# Altium schematic sheet WX0.007.419DL.SchDoc
size A3
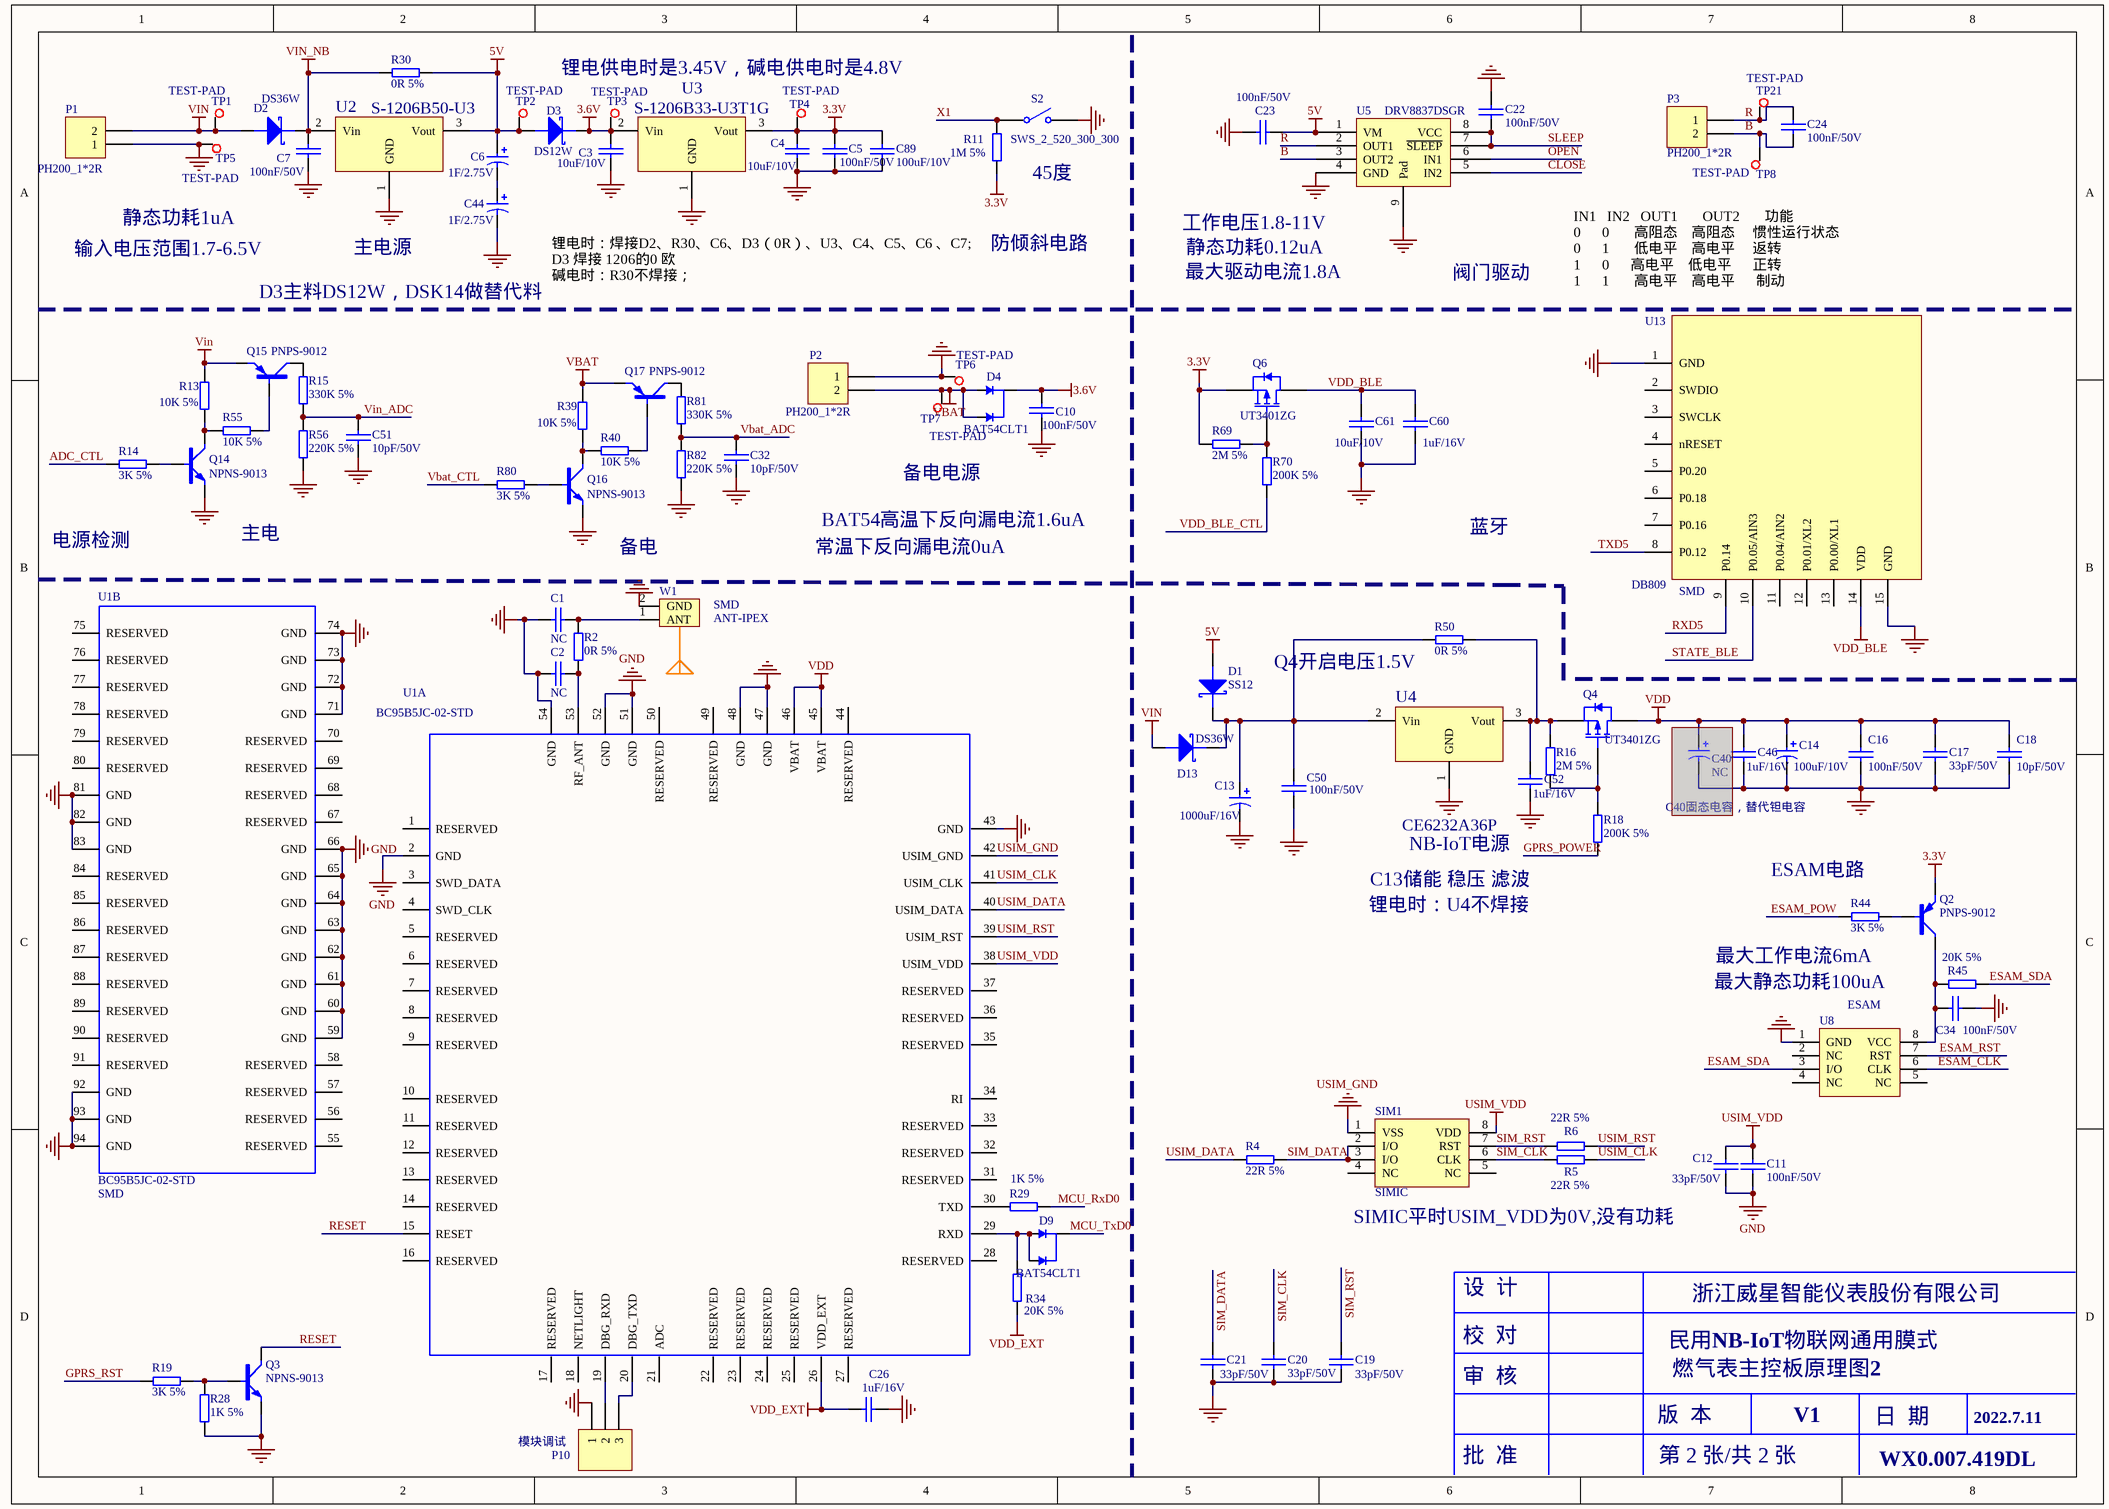
[diagram p0: WX0.007.419DL.SchDoc]

## Parts
C1  NC  [CAP0603]
C2  NC  [CAP0603]
C3  10uF/10V  [CAP0603]
C4  10uF/10V  [CAP0603]
C5  100nF/50V  [CAP0603]
C6  1F/2.75V  [CAPPC_350_800_1600R]
C7  100nF/50V  [CAP0603]
C10  100nF/50V  [CAP0603]
C11  100nF/50V  [CAP0603]
C12  33pF/50V  [CAP0603]
C13  1000uF/16V  [CAPPC_500_800_2000R]
C14  100uF/10V  [CAT3528]
C16  100nF/50V  [CAP0603]
C17  33pF/50V  [CAP0603]
C18  10pF/50V  [CAP0603]
C19  33pF/50V  [CAP0603]
C20  33pF/50V  [CAP0603]
C21  33pF/50V  [CAP0603]
C22  100nF/50V  [CAP0603]
C23  100nF/50V  [CAP0603]
C24  100nF/50V  [CAP0603]
C26  1uF/16V  [CAP0603]
C32  10pF/50V  [CAP0603]
C34  100nF/50V  [CAP0603]
C40  NC  [6.3*5.8]  (masked out: inside a compile mask, not in the netlist)
C44  1F/2.75V  [CAPPC_350_800_1600R]
C46  1uF/16V  [CAP0603]
C50  100nF/50V  [CAP0603]
C51  10pF/50V  [CAP0603]
C52  1uF/16V  [CAP0603]
C60  1uF/16V  [CAP0603]
C61  10uF/10V  [CAP0603]
C89  100uF/10V  [CAT3528]
D1  SS12  [DO-214AC]
D2  DS36W  [SOD-123FL]
D3  DS12W  [SOD-123FL]
D4  BAT54CLT1  [SOT-23]
D9  BAT54CLT1  [SOT-23]
D13  DS36W  [SOD-123FL]
P1  PH200_1*2R  [PH200_1*2R]
P2  PH200_1*2R  [PH200_1*2R]
P3  PH200_1*2R  [PH200_1*2R]
P10  模块调试  [PIN254_1*3*WXHJ]
Q2  PNPS-9012  [SOT-23]
Q3  NPNS-9013  [SOT-23]
Q4  UT3401ZG  [SOT-23]
Q6  UT3401ZG  [SOT-23]
Q14  NPNS-9013  [SOT-23]
Q15  PNPS-9012  [SOT-23]
Q16  NPNS-9013  [SOT-23]
Q17  PNPS-9012  [SOT-23]
R2  0R 5%  [RES0603]
R4  22R 5%  [RES0603]
R5  22R 5%  [RES0603]
R6  22R 5%  [RES0603]
R11  1M 5%  [RES0603]
R13  10K 5%  [RES0603]
R14  3K 5%  [RES0603]
R15  330K 5%  [RES0603]
R16  2M 5%  [RES0603]
R18  200K 5%  [RES0603]
R19  3K 5%  [RES0603]
R28  1K 5%  [RES0603]
R29  1K 5%  [RES0603]
R30  0R 5%  [RES1206]
R34  20K 5%  [RES0603]
R39  10K 5%  [RES0603]
R40  10K 5%  [RES0603]
R44  3K 5%  [RES0603]
R45  20K 5%  [RES0603]
R50  0R 5%  [RES1206]
R55  10K 5%  [RES0603]
R56  220K 5%  [RES0603]
R69  2M 5%  [RES0603]
R70  200K 5%  [RES0603]
R80  3K 5%  [RES0603]
R81  330K 5%  [RES0603]
R82  220K 5%  [RES0603]
S2  SWS_2_520_300_300  [SWS_2_520_300]
SIM1  SIMIC  [SIMIC]
TP1  TEST-PAD  [TEST-PAD]
TP2  TEST-PAD  [TEST-PAD]
TP3  TEST-PAD  [TEST-PAD]
TP4  TEST-PAD  [TEST-PAD]
TP5  TEST-PAD  [TEST-PAD]
TP6  TEST-PAD  [TEST-PAD]
TP7  TEST-PAD  [TEST-PAD]
TP8  TEST-PAD  [TEST-PAD]
TP21  TEST-PAD  [TEST-PAD]
U1  BC95B5JC-02-STD  SMD/DIP: SMD  [BC95B5JB-02-STD]  (parts A,B of 2)
U2  S-1206B50-U3  [SOT-89]
U3  S-1206B33-U3T1G  [SOT-89]
U4  CE6232A36P  [SOT-89]
U5  DRV8837DSGR  [S-PWSON-N8]
U8  ESAM  [SOP-8L-200MIL]
U13  DB809  SMD/DIP: SMD  [DB809]
W1  ANT-IPEX  [ANT-IPEX]

## Nets
3.3V: C4.1 C5.1 C89.1 Q2.2(E) Q6.2(S) R11.1 R69.1 TP4.1 U3.3(Vout)
3.6V: C3.1 C10.1 D3.2 D4.3(C) TP3.1 U3.2(Vin)
5V: C6.1 C23.2 D1.1 D3.1 R30.2 TP2.1 U2.3(Vout) U5.1(VM)
GND: C1.1 C2.1 C3.2 C4.2 C5.2 C7.2 C10.2 C11.2 C12.2 C13.2 C14.2 C16.2 C17.2 C18.2 C19.2 C20.2 C21.2 C22.1 C23.1 C26.2 C32.1 C34.2 C44.2 C46.2 C50.2 C51.1 C52.2 C60.2 C61.2 C89.2 P1.1 P2.1 P10.1 Q3.2(E) Q14.2(E) Q16.2(E) R28.1 R56.2 R82.2 S2.2 TP5.1 TP6.1 U1.2(GND) U1.43(GND) U1.47(GND) U1.48(GND) U1.51(GND) U1.52(GND) U1.54(GND) U1.59(GND) U1.60(GND) U1.61(GND) U1.62(GND) U1.63(GND) U1.64(GND) U1.65(GND) U1.66(GND) U1.71(GND) U1.72(GND) U1.73(GND) U1.74(GND) U1.81(GND) U1.82(GND) U1.83(GND) U1.92(GND) U1.93(GND) U1.94(GND) U2.1(GND) U3.1(GND) U4.1(GND) U5.4(GND) U5.9(Pad) U8.1(GND) U13.1(GND) U13.15(GND) W1.2(GND)
USIM_GND: SIM1.1(VSS) U1.42(USIM_GND)
USIM_VDD: C11.1 C12.1 SIM1.8(VDD) U1.38(USIM_VDD)
VBAT: D4.1(A) D4.2(A) P2.2 Q17.2(E) R39.2 TP7.1
VDD: C14.1 C16.1 C17.1 C18.1 C46.1 Q4.3(D) U1.45(VBAT) U1.46(VBAT)
VDD_BLE: C60.1 C61.1 Q6.3(D) U13.14(VDD)
VDD_EXT: C26.1 R34.1 U1.26(VDD_EXT)
VIN: D2.1 D13.1 P1.2 Q15.2(E) R13.2 TP1.1
VIN_NB: C7.1 D2.2 R30.1 U2.2(Vin)
ADC_CTL: R14.1
B: C24.2 P3.2 TP8.1 U5.3(OUT2)
CLOSE: U5.5(IN2)
ESAM_CLK: U8.6(CLK)
ESAM_POW: R44.1
ESAM_RST: U8.7(RST)
ESAM_SDA: R45.2 U8.3(I/O)
GPRS_POWER: R18.1
GPRS_RST: R19.1
MCU_RxD0: R29.2
MCU_TxD0: D9.3(C)
OPEN: U5.6(IN1)
R: C24.1 P3.1 TP21.1 U5.2(OUT1)
RESET: Q3.3(C) U1.15(RESET)
RXD5: U13.9(P0.14)
SIM_CLK: C20.1 R5.1 SIM1.6(CLK)
SIM_DATA: C21.1 R4.2 SIM1.2(I/O) SIM1.3(I/O)
SIM_RST: C19.1 R6.1 SIM1.7(RST)
SLEEP: C22.2 U5.7(~{SLEEP}) U5.8(VCC)
STATE_BLE: U13.10(P0.05/AIN3)
TXD5: U13.8(P0.12)
USIM_CLK: R5.2 U1.41(USIM_CLK)
USIM_DATA: R4.1 U1.40(USIM_DATA)
USIM_RST: R6.2 U1.39(USIM_RST)
Vbat_ADC: C32.2 R81.2 R82.1
Vbat_CTL: R80.1
VDD_BLE_CTL: R70.1
Vin_ADC: C51.2 R15.2 R56.1
X1: R11.2 S2.1
NetC1_2: C1.2 R2.1 W1.1(ANT)
NetC2_2: C2.2 R2.2 U1.53(RF_ANT)
NetC6_2: C6.2 C44.1
NetC13_1: C13.1 C50.1 D1.2 D13.2 R50.1 U4.2(Vin)
NetC34_1: C34.1 Q2.3(C) R45.1 U8.8(VCC)
NetC52_1: C52.1 Q4.2(S) R16.2 R50.2 U4.3(Vout)
NetD9_1: D9.1(A) D9.2(A) R34.2 U1.29(RXD)
NetP10_2: P10.2 U1.19(DBG_RXD)
NetP10_3: P10.3 U1.20(DBG_TXD)
NetQ2_1: Q2.1(B) R44.2
NetQ3_1: Q3.1(B) R19.2 R28.2
NetQ4_1: Q4.1(G) R16.1 R18.2
NetQ6_1: Q6.1(G) R69.2 R70.2
NetQ14_1: Q14.1(B) R14.2
NetQ14_3: Q14.3(C) R13.1 R55.1
NetQ15_1: Q15.1(B) R55.2
NetQ15_3: Q15.3(C) R15.1
NetQ16_1: Q16.1(B) R80.2
NetQ16_3: Q16.3(C) R39.1 R40.1
NetQ17_1: Q17.1(B) R40.2
NetQ17_3: Q17.3(C) R81.1
NetR29_1: R29.1 U1.30(TXD)

Not connected (* = marked no-connect by the designer): SIM1 4(NC) 5(NC); U1 1(RESERVED) 3(SWD_DATA) 4(SWD_CLK) 5(RESERVED) 6(RESERVED) 7(RESERVED) 8(RESERVED) 9(RESERVED) 10(RESERVED) 11(RESERVED) 12(RESERVED) 13(RESERVED) 14(RESERVED) 16(RESERVED) 17(RESERVED) 18(NETLIGHT) 21(ADC) 22(RESERVED) 23(RESERVED) 24(RESERVED) 25(RESERVED) 27(RESERVED) 28(RESERVED) 31(RESERVED) 32(RESERVED) 33(RESERVED) 34(RI) 35(RESERVED) 36(RESERVED) 37(RESERVED) 44(RESERVED) 49(RESERVED) 50(RESERVED) 55(RESERVED) 56(RESERVED) 57(RESERVED) 58(RESERVED) 67(RESERVED) 68(RESERVED) 69(RESERVED) 70(RESERVED) 75(RESERVED) 76(RESERVED) 77(RESERVED) 78(RESERVED) 79(RESERVED) 80(RESERVED) 84(RESERVED) 85(RESERVED) 86(RESERVED) 87(RESERVED) 88(RESERVED) 89(RESERVED) 90(RESERVED) 91(RESERVED); U8 2(NC) 4(NC) 5(NC); U13 2(SWDIO) 3(SWCLK) 4(nRESET) 5(P0.20) 6(P0.18) 7(P0.16) 11(P0.04/AIN2) 12(P0.01/XL2) 13(P0.00/XL1)

## Notes on the sheet
- 锂电供电时是3.45V，碱电供电时是4.8V
- 45度
- 静态功耗1uA
- 工作电压1.8-11V
- 输入电压范围1.7-6.5V
- D3主料DS12W，DSK14做替代料
- 主电源
- 锂电时：焊接D2、R30、C6、D3（0R）、U3、C4、C5、C6 、C7; D3 焊接 1206的0 欧
  碱电时：R30不焊接；
- 防倾斜电路
- 最大驱动电流1.8A
- 静态功耗0.12uA
- 阀门驱动
- IN1   IN2   OUT1       OUT2       功能
  0      0       高阻态    高阻态     惯性运行状态
  0      1       低电平    高电平     返转
  1      0      高电平    低电平      正转
  1      1       高电平    高电平      制动
- 备电电源
- 电源检测
- 主电
- 备电
- 常温下反向漏电流0uA
- BAT54高温下反向漏电流1.6uA
- 蓝牙
- Q4开启电压1.5V
- NB-IoT电源
- C40固态电容，替代钽电容
- 锂电时：U4不焊接
- C13储能 稳压 滤波
- (near R44) ESAM电路
- 最大静态功耗100uA
- 最大工作电流6mA
- SIMIC平时USIM_VDD为0V,没有功耗
- 设  计
- 浙江威星智能仪表股份有限公司
- 审  核
- 校  对
- 民用NB-IoT物联网通用膜式
- 燃气表主控板原理图2
- 批  准
- 版  本
- 第 2 张/共 2 张
- V1
- 日  期
- 2022.7.11
- WX0.007.419DL

## Library data of the parts
C1 C2 = 101020103-0005: 12P,50 V,±5%,0603,国巨,CC0603JRNPO9BN12; Part Name: 0603贴片电容; ID: 11; SMD/DIP: SMD; Part Number: 101020103-0005
C3 C4 C61 = 101020103-0026: 106pF,10 V,±10%,0603,村田,GRM188R61A106KE47D; Part Name: 0603贴片电容; ID: 8; SMD/DIP: SMD; Part Number: 101020103-0026
C5 C7 C10 C11 C16 C22-C24 C34 C50 = 101020103-0021: 104pF,50 V,±10%,0603,国巨,CC0603KRX7R9BB104; Part Name: 0603贴片电容; ID: 3; SMD/DIP: SMD; Part Number: 101020103-0021
C6 C44 = 1010202-0015: 1F,2.75 V,-20%~+20%,8mm*16mm,红宝石,2.7 DMC 1 M MY4 8X16; Part Name: 法拉电容; ID: 12; SMD/DIP: DIP; Part Number: 1010202-0015
C12 C17 C19-C21 = 101020103-0027: 33pF,50 V,±10%,0603,国巨,CC0603KRNPO9BN33; Part Name: 0603贴片电容; ID: 18; SMD/DIP: SMD; Part Number: 101020103-0027
C13 = 1010203-0029: 1000uF,16 V,±20%,8*20mm,Rubycon,16ZLH1000M; Part Name: 电解电容; ID: 2; SMD/DIP: DIP; Part Number: 1010203-0029
C14 = 1010205-0006: 100UF,10 V,±20%,3528,AVX / KEMET,TAJB107M010RNJ; Part Name: 3528贴片钽电容; ID: 5; SMD/DIP: SMD; Part Number: 1010205-0006
C18 C32 C51 = 101020103-0014: 10pF,50 V,±5%,0603,X7R,国巨,CC0603JRNPO9BN100; Part Name: 0603贴片电容; ID: 7; SMD/DIP: SMD; Part Number: 101020103-0014
C26 C46 C52 C60 = 101020103-0003: 105pF,16 V,±10%,0603,国巨,CC0603KRX7R7BB105; Part Name: 0603贴片电容; ID: 14; SMD/DIP: SMD; Part Number: 101020103-0003
C40 = SolidCap: 固态电容
C89 = 101020102-0012: 226P,10 V,±20%,0805,村田电子有限公司,GRM21BR61A226ME51L; Part Name: 贴片电容; ID: 20; SMD/DIP: SMD; Part Number: 101020102-0012
D1 = 101040101-0009: SS12,DO-214AC,1 A,0.55 V,20 V,昶鑫,SS12; Part Name: 贴片肖特基; ID: 13; SMD/DIP: SMD; Part Number: 101040101-0009
D2 = 101040101-0055: DS36W,SOD123-FL,3 A,42 V,60 V,浙江领晨科技有限公司,DS36W; Part Name: 贴片肖特基; ID: 34; SMD/DIP: SMD; Part Number: 101040101-0055
D3 = 101040101-0048: DS12W,SOD-123FL,1 A,0.55 V,20 V,领晨科技,DS12W; Part Name: 贴片肖特基; ID: 8; SMD/DIP: SMD; Part Number: 101040101-0048
D4 D9 = 101040101-0038: BAT54CLT1，SOT23-3,SOT23-3,0.2 A,0.8 V,30 V,安森美,BAT54CLT1; Part Name: 贴片肖特基; ID: 31; SMD/DIP: SMD; Part Number: 101040101-0038
D13 = 101040101-0048: DS36W,SOD123-FL,3 A,42 V,60 V,浙江领晨科技有限公司,DS36W; Part Number: 101040101-0055; Part Name: 贴片肖特基; ID: 8; SMD/DIP: SMD
P1-P3 = 1010902-0105: 2.0-2AW,直插弯座，2PIN，脚间距2mm，带防翘起,公头,单排,2.0-2AW;直插弯座，2PIN,脚间距2mm，带防翘起; Part Name: PH座; ID: 11; SMD/DIP: DIP; Part Number: 1010902-0105
P10 = AD_WXHJ_PinHeader_04: 1*3 ，Φ1.0 ，2.54mm，直脚,无需焊接器件; Part Name: 排针; ID: 27; SMD/DIP: DIP; Part Number: AD_WXHJ_PinHeader_04
Q2 = 101040201-0001: 9012,PNP,SOT-23,JCET;长电,S9012; Part Name: 贴片三极管; ID: 16; SMD/DIP: SMD; Part Number: 101040201-0001
Q3 = 101040201-0002: 9013,NPN,SOT-23,长电,S9013; Part Name: 贴片三极管; ID: 14; SMD/DIP: SMD; Part Number: 101040201-0002
Q4 Q6 = 101040201-0013: UT3401ZG,P-MOS,SOT-23,UTC,UT3401ZG; Part Name: 功率MOS管; ID: 18; SMD/DIP: SMD; Part Number: 101040201-0013
Q14 Q16 = 101040201-0002: 9013,NPN,SOT-23,长电,S9013; Part Name: 贴片三极管; ID: 15; SMD/DIP: SMD; Part Number: 101040201-0002
Q15 Q17 = 101040201-0001: 9012,PNP,SOT-23,JCET;长电,S9012; Part Name: 贴片三极管; ID: 17; SMD/DIP: SMD; Part Number: 101040201-0001
R2 = 101010103-0001: 国巨,±5%,0603,,155 ℃,-55 ℃,RC0603J2-070RL,无铅,200 ppm/℃,1/10W,,0R; Part Name: 0603贴片电阻; ID: 1; SMD/DIP: SMD; Part Number: 101010103-0001
R4-R6 = 101010103-0009: 国巨,±5%,0603,,155 ℃,-55 ℃,RC0603JR-0722RL,无铅,200 ppm/℃,1/10W,,22欧; Part Name: 0603贴片电阻; ID: 17; SMD/DIP: SMD; Part Number: 101010103-0009
R11 = 101010103-0002: 国巨,±5%,0603,,155 ℃,-55 ℃,RC0603JR-071ML,无铅,200 ppm/℃,1/10W,,1M; Part Name: 0603贴片电阻; ID: 10; SMD/DIP: SMD; Part Number: 101010103-0002
R13 R39 R40 R44 R55 = 101010103-0003: 国巨,±5%,0603,,155 ℃,-55 ℃,RC0603JR-0710KL,无铅,200 ppm/℃,1/10W,,10K; Part Name: 0603贴片电阻; ID: 7; SMD/DIP: SMD; Part Number: 101010103-0003
R14 R80 = 101010103-0006: 国巨,±5%,0603,,155 ℃,-55 ℃,RC0603JR-073KL,无铅,100 ppm/℃,1/10W,,3K; Part Name: 0603贴片电阻; ID: 23; SMD/DIP: SMD; Part Number: 101010103-0006
R15 R81 = 101010103-0066: 330K,±5%,1/10W,0603,国巨,RC0603JR-07330KL; Part Name: 0603贴片电阻; ID: 31; SMD/DIP: SMD; Part Number: 101010103-0066
R16 = 101010103-0025: 国巨,±5%,0603,,155 ℃,-55 ℃,RC0603JR-072ML,含铅,100 ppm/℃,1/10W,,2M; Part Name: 0603贴片电阻; ID: 20; SMD/DIP: SMD; Part Number: 101010103-0025
R18 = 101010103-0034: 200K,±5%,1/10W,0603,国巨,RC0603JR-07200KL; Part Name: 0603贴片电阻; ID: 13; SMD/DIP: SMD; Part Number: 101010103-0034
R19 = 101010103-0006: 国巨,±5%,0603,,155 ℃,-55 ℃,RC0603JR-073KL,无铅,100 ppm/℃,1/10W,,3K; Part Name: 0603贴片电阻; ID: 22; SMD/DIP: SMD; Part Number: 101010103-0006
R28 = 101010103-0008: 1K,±5%,1/10W,0603,国巨,RC0603JR-071KL; Part Name: 0603贴片电阻; ID: 10; SMD/DIP: SMD; Part Number: 101010103-0008
R29 = 101010103-0008: 1K,±5%,1/10W,0603,国巨,RC0603JR-071KL; Part Name: 0603贴片电阻; ID: 9; SMD/DIP: SMD; Part Number: 101010103-0008
R30 R50 = 101010101-0013: 0Ω,±5%,1/4W,1206,国巨,RC1206JR-070RL; Part Name: 1206贴片电阻; ID: 2; SMD/DIP: SMD; Part Number: 101010101-0013
R34 R45 = 101010103-0004: 国巨,±5%,0603,,155 ℃,-55 ℃,RC0603JR-0720KL,无铅,200 ppm/℃,1/10W,,20K; Part Name: 0603贴片电阻; ID: 15; SMD/DIP: SMD; Part Number: 101010103-0004
R56 R82 = 101010103-0044: 220K,±5%,1/10W,0603,国巨,RC0603JR-07220KL; Part Name: 0603贴片电阻; ID: 30; SMD/DIP: SMD; Part Number: 101010103-0044
R69 R70 = 101010103-0003: 10K±5%,1/10W,0603; Part Name: 0603贴片电阻; ID: 32; Part Number: 101010103-0003
S2 = 1011001-0041: CSX-SEN-660B,垂直30°开关转换,3*5.2mm,360°任意方位倾斜检测,杭州航特科技有限公司; Part Name: 倾斜开关; ID: 33; SMD/DIP: SMD; Part Number: 1011001-0041
SIM1 = AD_XN_SIMIC_01: SIMIC虚拟器件; ID: 20; SMD/DIP: SMD; Part Number: AD_XN_SIMIC_01; Part Name: SIMIC
TP1-TP8 TP21 = AD_WXHJ_TEST-PAD_01: 单面焊盘测试点; Part Name: 测试点; ID: 23; SMD/DIP: SMD; Part Number: AD_WXHJ_TEST-PAD_01
U1 = 1011402-0141: BC95-B5,23.6mm*19.9mm*2.2mm,BC95B5JC-02-STD,LCC贴片封装,上海移远通信技术股份; Part Name: NB-IOT模块; ID: 18; Value: *; Part Description: *; PCB DECAL: *; Part Number: 1011402-0141
U2 = 1010503-0013: S-1206B50-U3,S-1206B50-U3,SOT89-3,6.5 V,1.7 V,0.2 V,5 V,250mA@VIN≧VOUT(S)＋1.0 V﹐1.5 V≦VOUT(S),1 uA,精工电子; Part Name: 贴片稳压器; ID: 6; SMD/DIP: SMD; Part Number: 1010503-0013
U3 = 1010503-0002: S-1206B33-U3T1G,S-1206B33-U3T1G,SOT89-3,6.5 V,1.7 V,0.15 V,3.3 V,250mA@VIN≧VOUT(S)＋1.0 V﹐1.5 V≦VOUT(S),1 uA,精工电子; Part Name: 线性稳压芯片; ID: 5; SMD/DIP: SMD; Part Number: 1010503-0002
U4 = 1010503-0031: CE6232A36P,CE6232A36P,SOT89-3,8 V,1.8 V,0.11 V,3.6 V,600mA,0.8 uA,南京芯力微电子有限公司; Part Name: 贴片稳压器; ID: 30; SMD/DIP: SMD; Part Number: 1010503-0031
U5 = 101050101-0060: DRV8837DSGR,S-PWSON-N8,TI,DRV8837DSGR; Part Name: 驱动芯片; ID: 23; SMD/DIP: SMD; Part Number: 101050101-0060
U8 = AD_XN_ESAM_01: ESAM虚拟器件; Part Name: ESAM芯片; ID: 11; SMD/DIP: SMD; Part Number: AD_XN_ESAM_01
U13 = 1011402-0194: 北高智蓝牙模块DB809; Part Name: 蓝牙模块; ID: 15; Part Number: 1011402-0194
W1 = 1010902-0053: IPEX，配GPRS天线转接线; Part Name: IPEX座; ID: 2; SMD/DIP: DIP; Part Number: 1010902-0053